# EAGLE design seismometer_sensorboard (EAGLE 7.0.0)
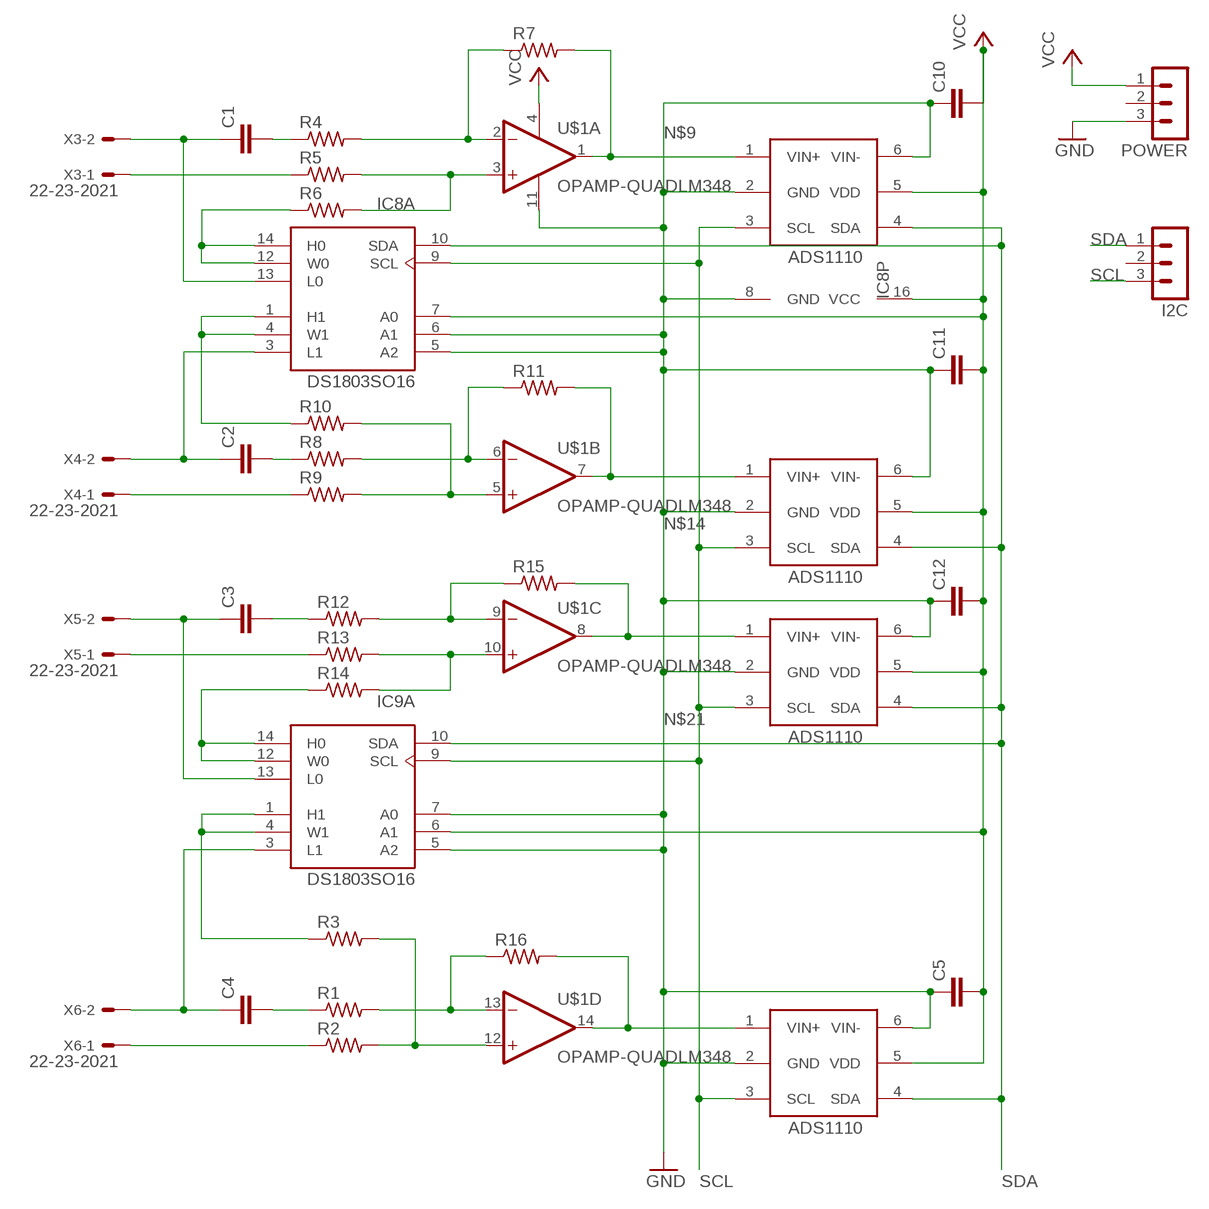
[diagram p0: schematic, sheet 1]

## Parts
C1  C-EU025-030X050  [C025-030X050]
C2  C-EU025-030X050  [C025-030X050]
C3  C-EU025-030X050  [C025-030X050]
C4  C-EU025-030X050  [C025-030X050]
C5  C-EU025-030X050  [C025-030X050]
C10  C-EU025-030X050  [C025-030X050]
C11  C-EU025-030X050  [C025-030X050]
C12  C-EU025-030X050  [C025-030X050]
I2C  MA03-1  [MA03-1]
IC1  ADS1110  [SOT-23-6]
IC4  ADS1110  [SOT-23-6]
IC5  ADS1110  [SOT-23-6]
IC6  ADS1110  [SOT-23-6]
IC8  DS1803SO16  [SO16]
IC9  DS1803SO16  [SO16]
POWER  MA03-1  [MA03-1]
R1  R-US_0207/12  [0207/12]
R2  R-US_0207/12  [0207/12]
R3  R-US_0207/12  [0207/12]
R4  R-US_0207/12  [0207/12]
R5  R-US_0207/12  [0207/12]
R6  R-US_0207/12  [0207/12]
R7  R-US_0207/12  [0207/12]
R8  R-US_0207/12  [0207/12]
R9  R-US_0207/12  [0207/12]
R10  R-US_0207/12  [0207/12]
R11  R-US_0207/12  [0207/12]
R12  R-US_0207/12  [0207/12]
R13  R-US_0207/12  [0207/12]
R14  R-US_0207/12  [0207/12]
R15  R-US_0207/12  [0207/12]
R16  R-US_0207/12  [0207/12]
U$1  OPAMP-QUADLM348  [DIP14]
X3  22-23-2021  [22-23-2021]
X4  22-23-2021  [22-23-2021]
X5  22-23-2021  [22-23-2021]
X6  22-23-2021  [22-23-2021]

## Nets
GND: C5.1 C10.1 C11.1 C12.1 IC1.2(GND) IC1.6(VIN-) IC4.2(GND) IC4.6(VIN-) IC5.2(GND) IC5.6(VIN-) IC6.2(GND) IC6.6(VIN-) IC8.5(A:A2) IC8.6(A:A1) IC8.8(P:GND) IC9.5(A:A2) IC9.7(A:A0) POWER.3 U$1.11(SUP:VEE)
N$1: C1.1 IC8.13(A:L0) X3.2
N$2: C1.2 R4.1
N$3: R5.1 X3.1
N$5: C2.1 IC8.3(A:L1) X4.2
N$6: R4.2 R7.1 U$1.2(A:IN-)
N$7: R5.2 R6.2 U$1.3(A:IN+)
N$8: IC8.1(A:H1) IC8.4(A:W1) R10.1
N$9: IC4.1(VIN+) R7.2 U$1.1(A:OUT)
N$10: R9.1 X4.1
N$11: C2.2 R8.1
N$12: R9.2 R10.2 U$1.5(B:IN+)
N$13: R8.2 R11.1 U$1.6(B:IN-)
N$14: IC5.1(VIN+) R11.2 U$1.7(B:OUT)
N$15: C3.1 IC9.13(A:L0) X5.2
N$16: C4.1 IC9.3(A:L1) X6.2
N$17: R13.1 X5.1
N$18: R13.2 R14.2 U$1.10(C:IN+)
N$19: R12.2 R15.1 U$1.9(C:IN-)
N$20: C3.2 R12.1
N$21: IC6.1(VIN+) R15.2 U$1.8(C:OUT)
N$22: C4.2 R1.1
N$23: R2.1 X6.1
N$24: IC8.12(A:W0) IC8.14(A:H0) R6.1
N$25: IC9.1(A:H1) IC9.4(A:W1) R3.1
N$26: R2.2 R3.2 U$1.12(D:IN+)
N$27: R1.2 R16.1 U$1.13(D:IN-)
N$28: IC1.1(VIN+) R16.2 U$1.14(D:OUT)
N$35: IC9.12(A:W0) IC9.14(A:H0) R14.1
SCL: I2C.3 IC1.3(SCL) IC4.3(SCL) IC5.3(SCL) IC6.3(SCL) IC8.9(A:SCL) IC9.9(A:SCL)
SDA: I2C.1 IC1.4(SDA) IC4.4(SDA) IC5.4(SDA) IC6.4(SDA) IC8.10(A:SDA) IC9.10(A:SDA)
VCC: C5.2 C10.2 C11.2 C12.2 IC1.5(VDD) IC4.5(VDD) IC5.5(VDD) IC6.5(VDD) IC8.7(A:A0) IC8.16(P:VCC) IC9.6(A:A1) POWER.1 U$1.4(SUP:VCC)
Unconnected: I2C.2 POWER.2

## Power pins joined to a net without a drawn wire
GND: IC9.8(P:GND)
VCC: IC9.16(P:VCC)

## Library data of the parts
C1-C5 C10-C12 = rcl:C-EU: CAPACITOR, European symbol
I2C POWER = con-lstb:MA03-1: PIN HEADER; OC_FARNELL: unknown; OC_NEWARK: unknown
IC1 IC4-IC6 = ads11xx:ADS1110: Analog/Digital conventer i2c Bus max: 2.048v
IC8 IC9 = ds1803:DS1803?: Addresable Dual Digital Potentiometer
R1-R16 = resistor:R-US_: RESISTOR, American symbol
U$1 = Op Amps:OPAMP-QUAD: Operational amplifier, quad; SPICE: X{NAME}A {A.IN+.NET} {A.IN-.NET} {VCC.NET} {VEE.NET} {A.OUT.NET} LM348\nX{NAME}B {B.IN+.NET} {B.IN-.NET} {VCC.NET} {VEE.NET} {B.OUT.NET} LM348\nX{NAME}C {C.IN+.NET} {C.IN-.NET} {VCC.NET} {VEE.NET} {C.OUT.NET} LM348\nX{NAME}D {D.IN+.NET} {D.IN-.NET} {VCC.NET} {VEE.NET} {D.OUT.NET} LM348; SPICEMOD: .SUBCKT LM358 1 2 99 50 28\nIOS 2 1 5N\nR1 1 3 500K\nR2 3 2 500K\nI1 99 4 100U\nR3 5 50 517\nR4 6 50 517\nQ1 5 2 4 QX\nQ2 6 7 4 QX\nC4 5 6 128.27P\nI2 99 50 75U\nEOS 7 1 POLY(1) 16 49 2E-3 1\nR8 99 49 60K\nR9 49 50 60K\nV2 99 8 1.63\nD1 9 8 DX\nD2 10 9 DX\nV3 10 50 .635\nEH 99 98 99 49 1\nG1 98 9 POLY(1) 5 6 0 9.8772E-4 0 .3459\nR5 98 9 101.2433MEG\nC3 98 9 200P\nG3 98 15 9 49 1E-6\nR12 98 15 1MEG\nC5 98 15 7.9577E-14\nG4 98 16 3 49 5.6234E-8 \nL2 98 17 15.9M\nR13 17 16 1K\nF6 50 99 POLY(1) V6 300U 1\nE1 99 23 99 15 1\nR16 24 23 17.5\nD5 26 24 DX\nV6 26 22 .63V\nR17 23 25 17.5\nD6 25 27 DX\nV7 22 27 .63V\nV5 22 21 0.27V\nD4 21 15 DX\nV4 20 22 0.27V\nD3 15 20 DX\nL3 22 28 500P\nRL3 22 28 100K\n.MODEL DX D(IS=1E-15)\n.MODEL QX PNP(BF=1.111E3)\n.ENDS
X3-X6 = con-molex:22-23-2021: .100" (2.54mm) Center Header - 2 Pin; MF: MOLEX; MPN: 22-23-2021; OC_FARNELL: 1462926; OC_NEWARK: 25C3832

## Board
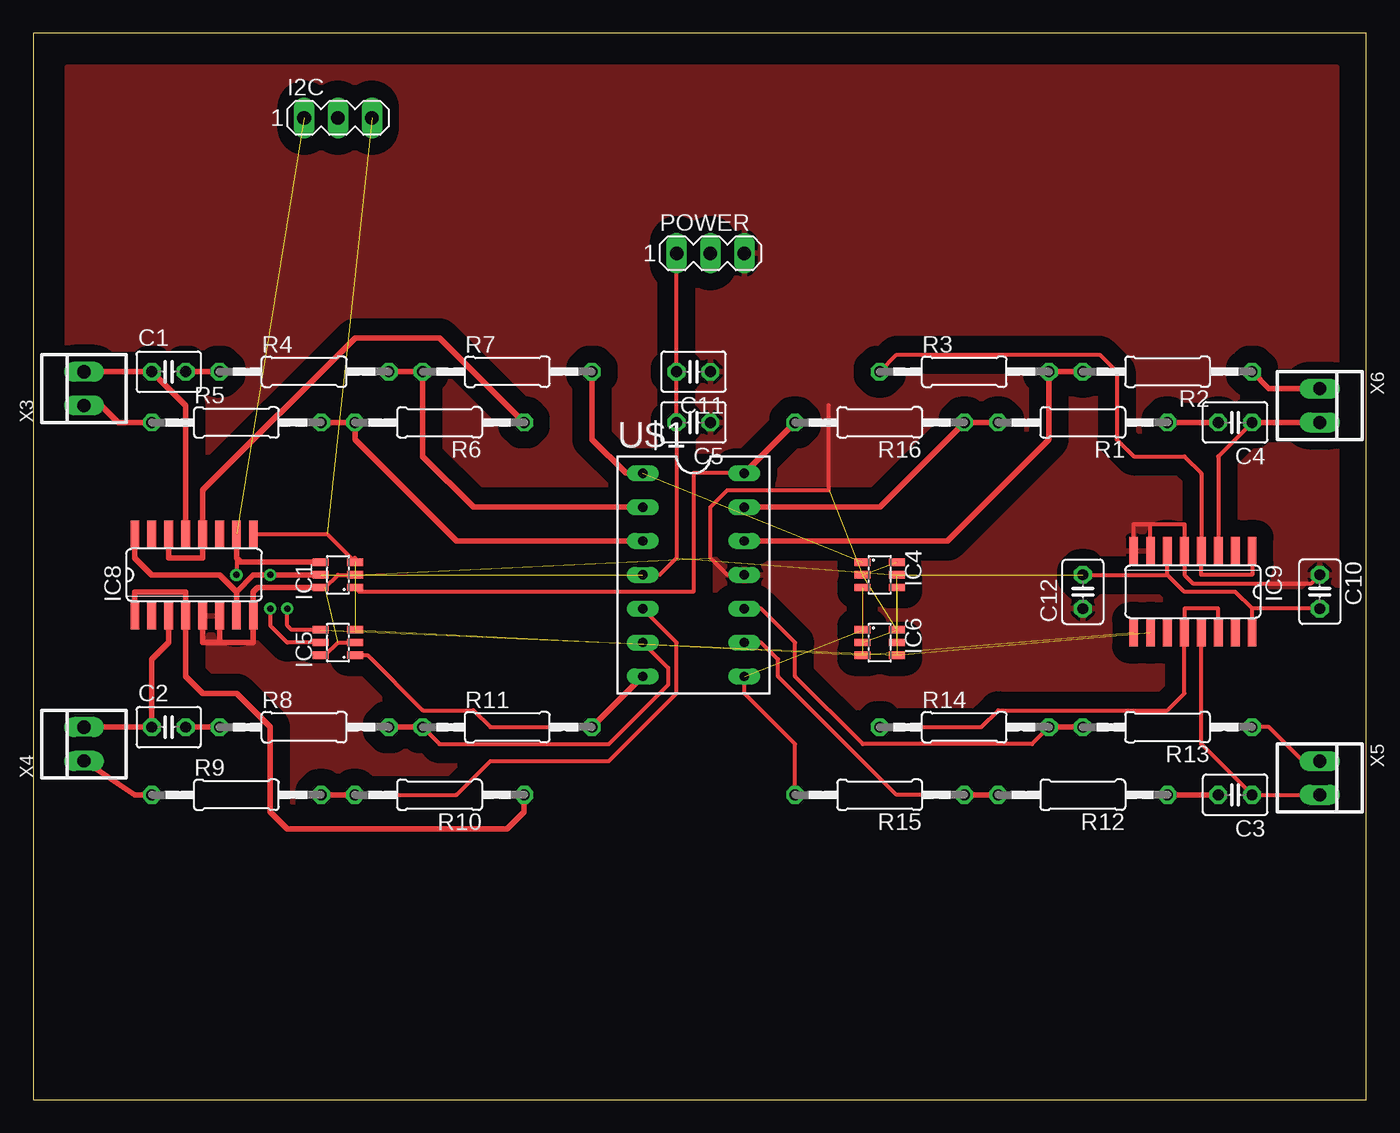
[diagram p1: board, top side]
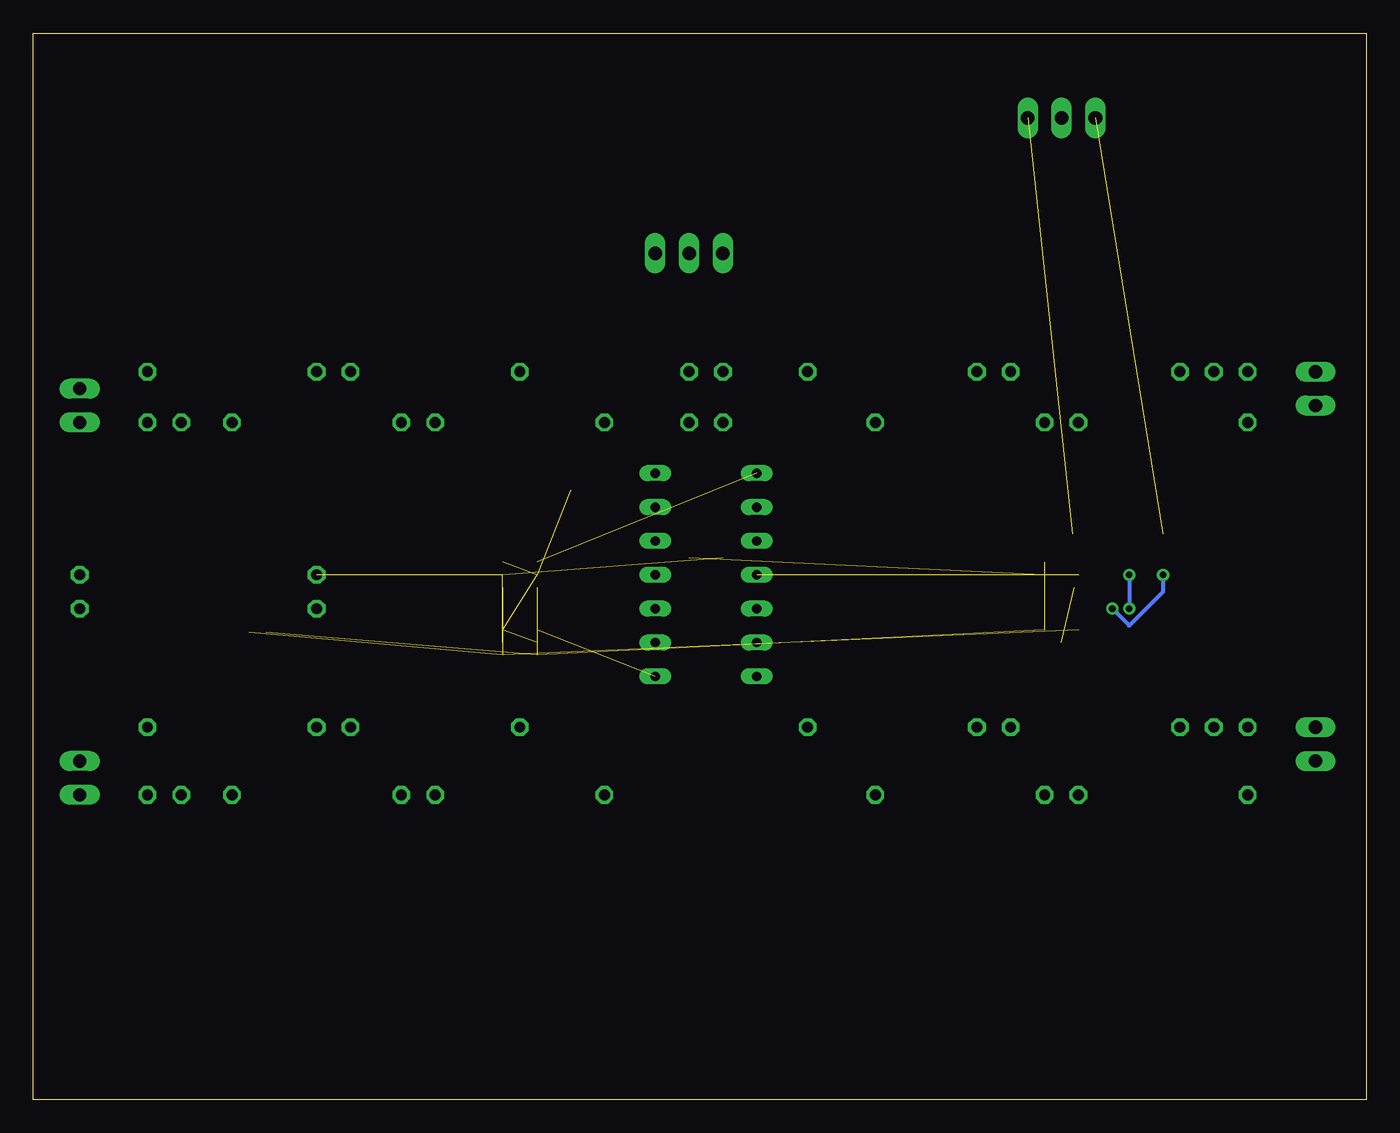
[diagram p2: board, bottom side, seen from below]

Size 100 x 80 mm. Coordinates in mm from the lower left corner, seen from the top.
Outline: 0,0 100,0 100,80 0,80 0,0
Copper layers (1*16): Top 0.035mm / dielectric 1.5mm / Bottom 0.035mm
Design rules "default": minimum track width 10mil, minimum drill 24mil, track to track 8mil, track to pad 8mil, pad to pad 8mil, via to via 8mil, smd to smd 8mil, copper to edge 40mil, drill to drill 8mil, minimum pad ring 10mil, minimum via ring 8mil, stop-mask expansion 4mil, vias tented up to drill 0mil, thermal gap 10mil

### Footprints (pad centres in the part's own frame; a part is rotated, then mirrored left to right if it is on the bottom)
C025-030X050 = drill 0.813 octagon: 1 -1.27,0; 2 1.27,0
MA03-1 = drill 1.016 long: 1 -2.54,0; 2 0,0; 3 2.54,0
SOT-23-6 = smd 0.55 x 1.2: 1 -0.95,-1.3; 2 0,-1.3; 3 0.95,-1.3; 4 0.95,1.3; 5 0,1.3; 6 -0.95,1.3
SO16 = smd 0.66 x 2.032: 1 -4.445,-3.073; 2 -3.175,-3.073; 3 -1.905,-3.073; 4 -0.635,-3.073; 5 0.635,-3.073; 6 1.905,-3.073; 7 3.175,-3.073; 8 4.445,-3.073; 9 4.445,3.073; 10 3.175,3.073; 11 1.905,3.073; 12 0.635,3.073; 13 -0.635,3.073; 14 -1.905,3.073; 15 -3.175,3.073; 16 -4.445,3.073
0207/12 = drill 0.813 octagon: 1 -6.35,0; 2 6.35,0
DIP14 = drill 0.7 long: 1 0,7.62; 2 0,5.08; 3 0,2.54; 4 0,0; 5 0,-2.54; 6 0,-5.08; 7 0,-7.62; 8 7.62,-7.62; 9 7.62,-5.08; 10 7.62,-2.54; 11 7.62,0; 12 7.62,2.54; 13 7.62,5.08; 14 7.62,7.62
22-23-2021 = drill 1 long: 1 -1.27,0; 2 1.27,0

### Placement (x,y rotation side)
C1  10.16,54.61 0 top
C2  10.16,27.94 0 top
C3  90.17,22.86 180 top
C4  90.17,50.8 180 top
C5  49.53,50.8 180 top
C10  96.52,38.1 270 top
C11  49.53,54.61 180 top
C12  78.74,38.1 90 top
I2C  22.86,73.66 0 top
IC1  22.86,39.37 90 top
IC4  63.5,39.37 270 top
IC5  22.86,34.29 90 top
IC6  63.5,34.29 270 top
IC8  12.06,39.37 0 top
IC9  87,38.1 180 top
POWER  50.8,63.5 0 top
R1  78.74,50.8 180 top
R2  85.09,54.61 180 top
R3  69.85,54.61 0 top
R4  20.32,54.61 0 top
R5  15.24,50.8 0 top
R6  30.48,50.8 180 top
R7  35.56,54.61 0 top
R8  20.32,27.94 0 top
R9  15.24,22.86 0 top
R10  30.48,22.86 180 top
R11  35.56,27.94 0 top
R12  78.74,22.86 180 top
R13  85.09,27.94 180 top
R14  69.85,27.94 0 top
R15  63.5,22.86 180 top
R16  63.5,50.8 180 top
U$1  45.72,39.37 0 top
X3  3.81,53.34 90 top
X4  3.81,26.67 90 top
X5  96.52,24.13 270 top
X6  96.52,52.07 270 top

### Tracks (layer width: path | path; a pad name or v marks a point on that pad's centre or on a via)
GND  (6 unrouted)
  Top 0.305: IC9.8 82.55,43.18 83.82,43.18 | IC9.7 83.82,43.18 | 83.82,43.18 86.36,43.18 IC9.5 86.36,39.37 87,38.73 95.89,38.73 C10.1 | U$1.11 52.07,39.37 50.8,40.64 50.8,44.45 52.07,45.72 59.69,45.72 59.69,52.07 | IC5.6 21.91,33.34 22.86,34.29 IC5.2 | IC1.6 21.91,38.42 22.86,39.37 IC1.2
  Top 0.406: IC8.5 12.7,34.29 13.97,34.29 | IC8.6 13.97,34.29 | 13.97,34.29 16.51,34.29 IC8.8 16.51,38.1 16.83,38.42 IC1.6
  pour Top (isolate 1.27): 2.54,2.54 2.54,77.47 97.79,77.47 97.79,2.54
N$1
  Top 0.406: X3.2 C1.1 11.43,52.07 IC8.13
N$2
  Top 0.406: C1.2 R4.1
N$3
  Top 0.406: X3.1 5.08,52.07 6.35,50.8 R5.1
N$5
  Top 0.406: X4.2 C2.1 8.89,33.02 10.16,34.29 IC8.3
N$6
  Top 0.406: R4.2 R7.1 29.21,48.26 33.02,44.45 U$1.2
N$7
  Top 0.406: R5.2 R6.2 24.13,49.53 31.75,41.91 U$1.3
N$8
  Top 0.406: R10.1 36.83,21.59 35.56,20.32 19.05,20.32 17.78,21.59 17.78,27.94 15.24,30.48 12.7,30.48 11.43,31.75 IC8.4 11.43,38.1 7.62,38.1 IC8.1
N$9  (1 unrouted)
  Top 0.406: R7.2 41.91,49.53 44.45,46.99 U$1.1
N$10
  Top 0.406: X4.1 7.62,22.86 R9.1
N$11
  Top 0.406: C2.2 R8.1
N$12
  Top 0.305: R10.2 31.75,22.86 34.29,25.4 43.18,25.4 48.26,30.48 48.26,34.29 U$1.5
  Top 0.406: R10.2 R9.2
N$13
  Top 0.305: R11.1 30.48,26.67 43.18,26.67 47.62,31.11 47.62,32.38 U$1.6
  Top 0.406: R8.2 R11.1
N$14
  Top 0.305: IC5.1 25.08,33.34 29.21,29.21 33.02,29.21 34.29,27.94 R11.2
  Top 0.406: R11.2 U$1.7
N$15
  Top 0.305: X5.2 C3.1 87.63,26.67 IC9.13
N$16
  Top 0.305: C4.1 88.9,48.26 IC9.3
  Top 0.406: C4.1 X6.2
N$17
  Top 0.305: X5.1 95.25,25.4 92.71,27.94 R13.1
N$18
  Top 0.305: R14.2 74.93,26.67 62.23,26.67 57.15,31.75 57.15,34.29 54.61,36.83 U$1.10
  Top 0.406: R13.2 R14.2
N$19
  Top 0.305: R15.1 64.77,22.86 55.88,31.75 55.88,33.02 54.61,34.29 U$1.9
  Top 0.406: R12.2 R15.1
N$20
  Top 0.406: C3.2 R12.1
N$21  (1 unrouted)
  Top 0.305: R15.2 57.15,26.67 53.34,30.48 U$1.8
N$22
  Top 0.406: R1.1 C4.2
N$23
  Top 0.406: X6.1 92.71,53.34 R2.1
N$24
  Top 0.406: IC8.14 10.16,40.64 12.7,40.64 IC8.12 12.7,45.72 24.13,57.15 30.48,57.15 R6.1
N$25
  Top 0.305: IC9.1 91.44,39.37 87.63,39.37 87.63,40.64 IC9.4 87.63,46.99 86.36,48.26 82.55,48.26 81.28,49.53 81.28,54.61 80.01,55.88 64.77,55.88 R3.1
N$26
  Top 0.406: R2.2 R3.2 76.2,49.53 68.58,41.91 U$1.12
N$27
  Top 0.406: R1.2 R16.1 63.5,44.45 U$1.13
N$28
  Top 0.305: U$1.14 49.53,46.99 49.53,38.1 24.48,38.1 IC1.1
  Top 0.406: U$1.14 R16.2
N$35
  Top 0.305: IC9.14 88.9,36.83 86.36,36.83 IC9.12 86.36,30.48 85.09,29.21 72.39,29.21 71.12,27.94 R14.1
SCL  (5 unrouted)
  Top 0.305: IC8.9 22.04,42.44 IC1.3 24.16,40.61 24.13,40.64
SDA  (via drill 0.5 pad 0.25)  (4 unrouted)
  Top 0.305: IC5.4 19.37,35.24 19.05,35.56 v19.05,36.83 | 15.24,40.64 v15.24,39.37
  Top 0.406: IC1.4 15.56,40.32 15.24,40.64 IC8.10
  Bottom 0.305: v19.05,36.83 17.78,35.56 15.24,38.1 v15.24,39.37
VCC  (via drill 0.5 pad 0.25)  (4 unrouted)
  Top 0.305: IC9.16 91.44,36.83 | 91.44,36.83 90.17,38.1 86.36,38.1 85.09,39.37 | 85.09,39.37 IC9.6 | C10.2 91.44,36.83 | C12.2 85.09,39.37 | U$1.4 46.99,39.37 48.26,40.64 C5.2 C11.2 POWER.1 | 21.59,34.29 IC5.5 19.05,34.29 17.78,35.56 v17.78,36.83
  Top 0.406: IC8.16 7.62,40.64 8.89,39.37 13.97,39.37 15.24,38.1 | 15.24,38.1 IC8.7 | IC1.5 v17.78,39.37 16.51,39.37 15.24,38.1
  Bottom 0.305: v17.78,39.37 v17.78,36.83